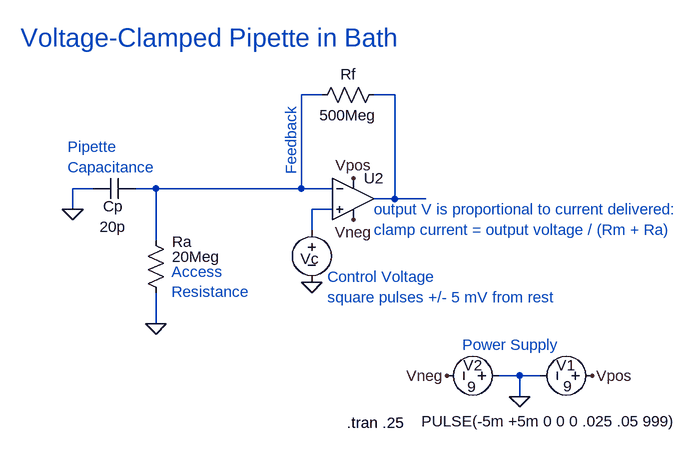
[diagram p0: schematic voltage-clamp-noCell.asc]
voltage-clamp-noCell.asc, the LTspice schematic file:
Version 4
SHEET 1 1292 680
WIRE 400 48 368 48
WIRE 512 48 480 48
WIRE 48 192 16 192
WIRE 144 192 112 192
WIRE 368 192 368 48
WIRE 368 192 144 192
WIRE 416 192 368 192
WIRE 512 208 512 48
WIRE 512 208 480 208
WIRE 560 208 512 208
WIRE 16 224 16 192
WIRE 416 224 384 224
WIRE 384 256 384 224
WIRE 144 272 144 192
WIRE 144 400 144 352
WIRE 704 480 672 480
WIRE 736 480 704 480
WIRE 704 512 704 480
FLAG 816 480 Vpos
FLAG 448 176 Vpos
FLAG 448 240 Vneg
FLAG 592 480 Vneg
FLAG 384 336 0
FLAG 144 400 0
FLAG 16 224 0
FLAG 704 512 0
SYMBOL res 496 32 R90
WINDOW 0 0 56 VBottom 2
WINDOW 3 32 56 VTop 2
SYMATTR InstName Rf
SYMATTR Value 500Meg
SYMBOL voltage 832 480 R90
WINDOW 0 -16 42 VRight 2
WINDOW 3 16 47 VRight 2
WINDOW 123 0 0 Left 0
WINDOW 39 0 0 Left 0
SYMATTR InstName V1
SYMATTR Value 9
SYMBOL OpAmps\\UniversalOpamp2 448 208 R0
SYMATTR InstName U2
SYMBOL voltage 688 480 R90
WINDOW 0 -16 41 VRight 2
WINDOW 3 17 51 VRight 2
WINDOW 123 0 0 Left 0
WINDOW 39 0 0 Left 0
SYMATTR InstName V2
SYMATTR Value 9
SYMBOL voltage 384 240 R0
WINDOW 0 -17 60 Left 2
WINDOW 3 169 310 Left 2
WINDOW 123 0 0 Left 0
WINDOW 39 0 0 Left 0
SYMATTR InstName Vc
SYMATTR Value PULSE(-5m +5m 0 0 0 .025 .05 999)
SYMBOL res 128 256 R0
WINDOW 0 41 18 Left 2
WINDOW 3 41 41 Left 2
SYMATTR InstName Ra
SYMATTR Value 20Meg
SYMBOL cap 112 176 R90
WINDOW 0 59 34 VBottom 2
WINDOW 3 59 34 VTop 2
SYMATTR InstName Cp
SYMATTR Value 20p
TEXT 408 328 Left 2 ;Control Voltage\nsquare pulses +/- 5 mV from rest
TEXT 480 224 Left 2 ;output V is proportional to current delivered:\nclamp current = output voltage / (Rm + Ra)
TEXT 8 128 Left 2 ;Pipette\nCapacitance
TEXT 168 320 Left 2 ;Access\nResistance
TEXT 616 432 Left 2 ;Power Supply
TEXT 352 64 VRight 2 ;Feedback
TEXT -64 -40 Left 4 ;Voltage-Clamped Pipette in Bath
TEXT 438 552 Left 2 !.tran .25

The netlist it stands for:
* voltage-clamp-noCell.asc
Rf N002 N001 500Meg
V1 Vpos 0 9
XU2 N003 N001 Vpos Vneg N002 level.2 Avol=1Meg GBW=10Meg Slew=10Meg ilimit=25m rail=0 Vos=0 phimargin=45 en=0 enk=0 in=0 ink=0 Rin=500Meg  ; pins IN+ IN- V+ V- OUT
V2 0 Vneg 9
Vc N003 0 PULSE(-5m +5m 0 0 0 .025 .05 999)
Ra N001 0 20Meg
Cp N001 0 20p
* Control Voltage
* square pulses +/- 5 mV from rest
* output V is proportional to current delivered:
* clamp current = output voltage / (Rm + Ra)
* Pipette
* Capacitance
* Access
* Resistance
* Power Supply
* Feedback
* Voltage-Clamped Pipette in Bath
.tran .25
.lib UniversalOpamps2.sub
.backanno
.end